# EAGLE design fabfm (EAGLE 6.3)
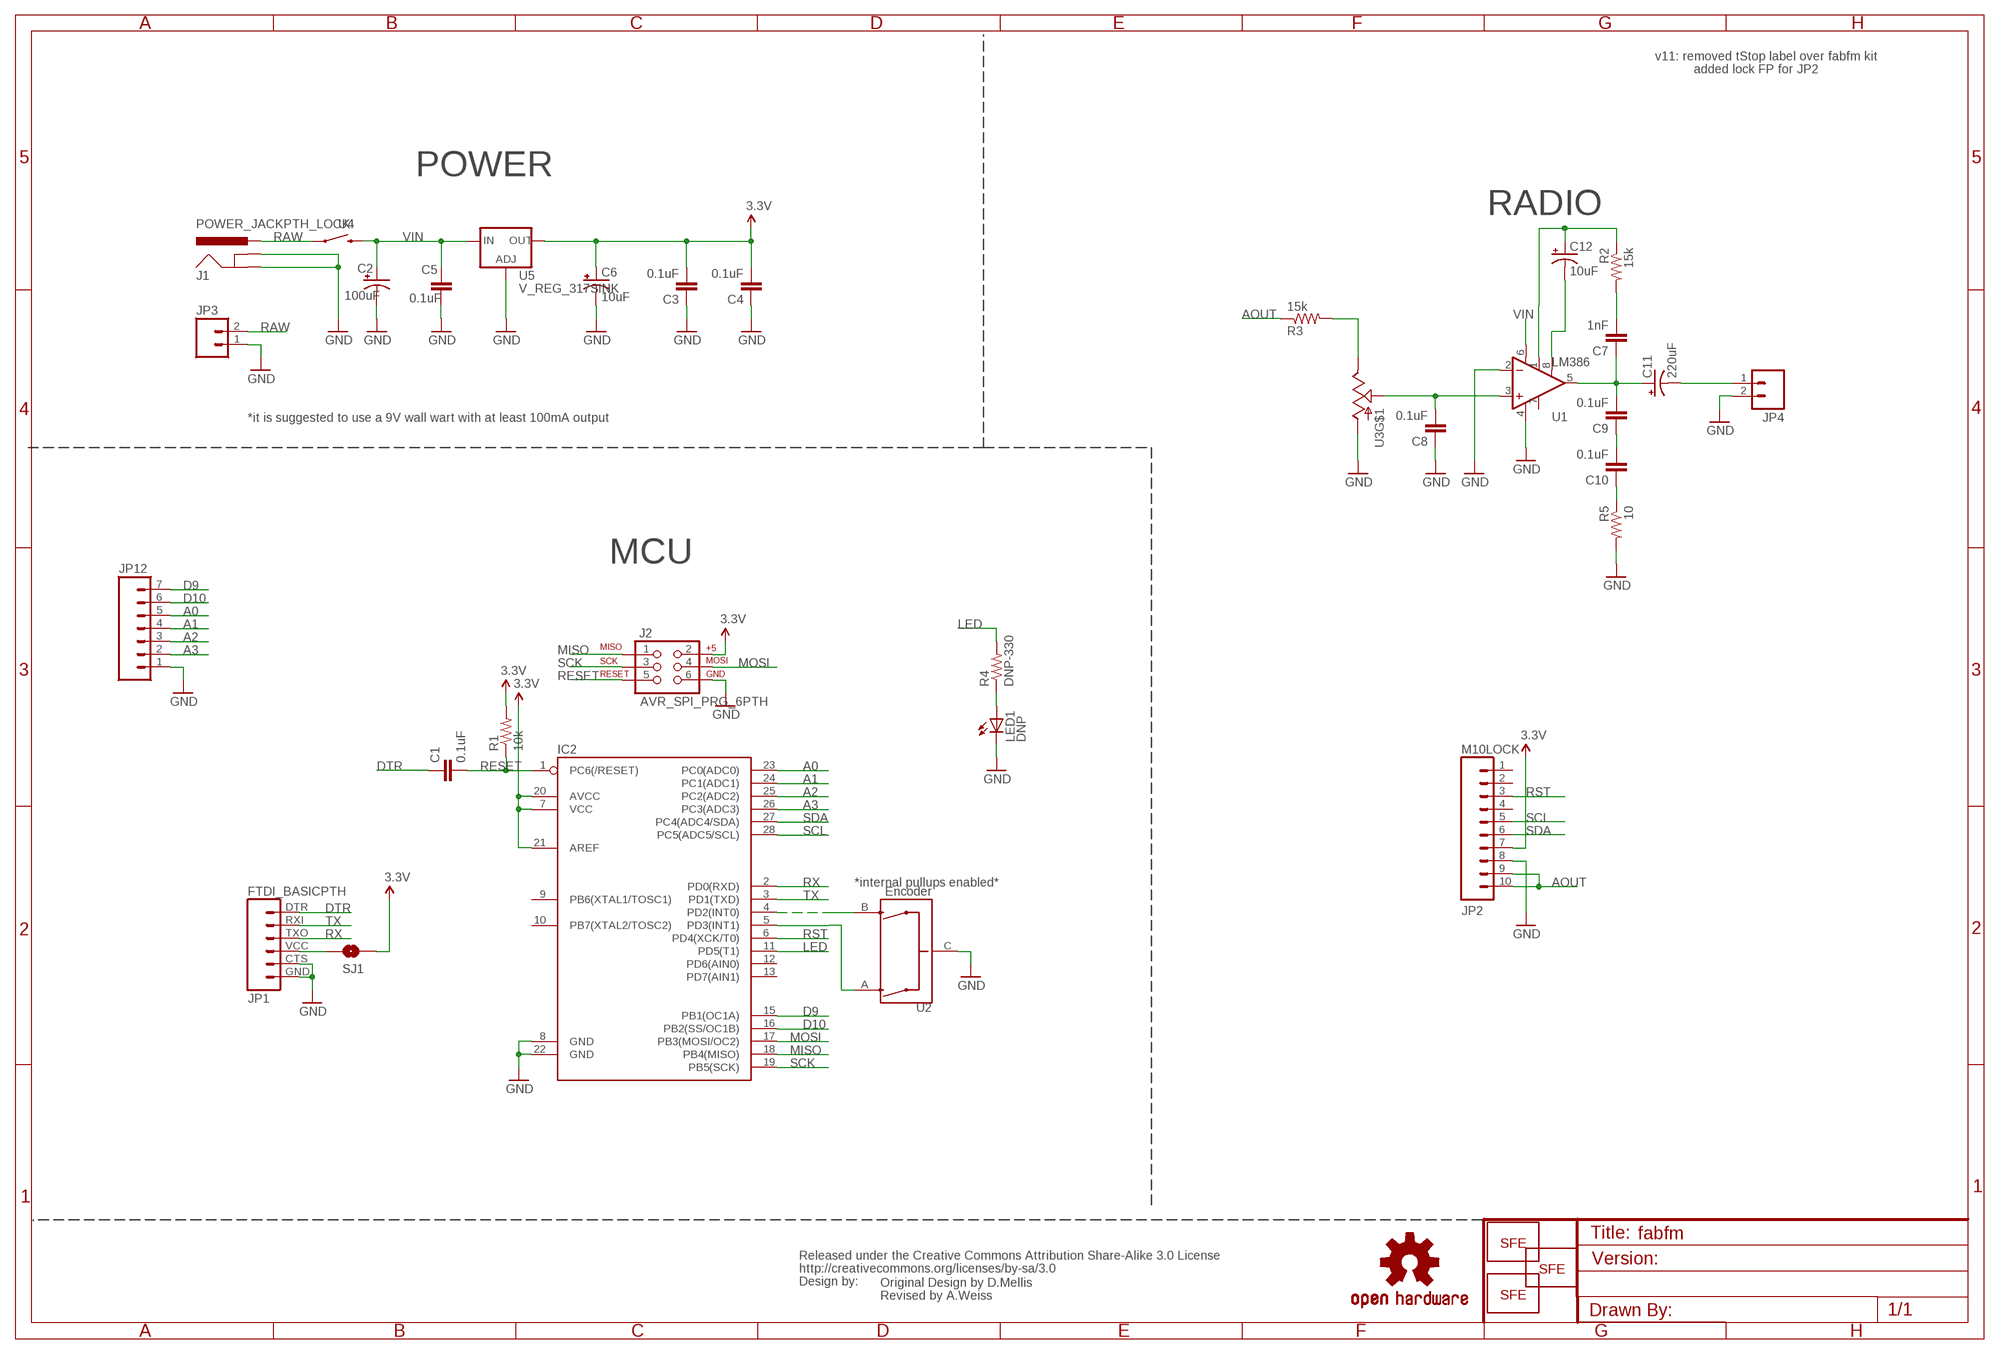
[diagram p0: schematic, sheet 1]

## Parts
C1  0.1uF  CAPKIT  [CAP-PTH-SMALL-KIT]
C2  100uF  CAP_POLPTH1  [CPOL-RADIAL-100UF-25V]
C3  0.1uF  CAPKIT  [CAP-PTH-SMALL-KIT]
C4  0.1uF  CAPKIT  [CAP-PTH-SMALL-KIT]
C5  0.1uF  CAPKIT  [CAP-PTH-SMALL-KIT]
C6  10uF  CAP_POLPTH2  [CPOL-RADIAL-10UF-25V]
C7  1nF  CAPKIT  [CAP-PTH-SMALL-KIT]
C8  0.1uF  CAPKIT  [CAP-PTH-SMALL-KIT]
C9  0.1uF  CAPKIT  [CAP-PTH-SMALL-KIT]
C10  0.1uF  CAPKIT  [CAP-PTH-SMALL-KIT]
C11  220uF  CAP_POLPTH1  [CPOL-RADIAL-100UF-25V]
C12  10uF  CAP_POLPTH2  [CPOL-RADIAL-10UF-25V]
IC2  ATMEGA328P_PDIP_EZ_PB0  [DIL28-EZ-PB0]
J1  POWER_JACKPTH_LOCK  [POWER_JACK_PTH_LOCK]
J2  AVR_SPI_PRG_6PTH  [2X3]
JP1  FTDI_BASICPTH  [FTDI_BASIC]
JP2  M10LOCK  [1X10_LOCK]
JP3  M02PTH  [1X02]
JP4  M02PTH4  [1X02_XTRA_BIG]
JP8  LOGO-SFESK  [SFE-LOGO-FLAME]
JP9  LOGO-SFENEW  [SFE-NEW-WEBLOGO]
JP11  LOGO-SFENEW  [SFE-NEW-WEBLOGO]
JP12  M07  [1X07]
LED1  DNP  LED3MM  [LED3MM]
R1  10k  RESISTORPTH-1/4W  [AXIAL-0.4]
R2  15k  RESISTORPTH-1/4W  [AXIAL-0.4]
R3  15k  RESISTORPTH-1/4W  [AXIAL-0.4]
R4  DNP-330  RESISTORPTH-1/4W  [AXIAL-0.4]
R5  10  RESISTORPTH-1/4W  [AXIAL-0.4]
SJ1  SOLDERJUMPERNO  [SJ_2S-NO]
U1  LM386  [DIP08]
U2  Encoder  ENCODER-QUADRATURE  [ENCODER-16MM-QUAD]
U3  POT_SWITCHPOT_PTH_SWITCH  [POT_PTH_SWITCH]
U5  V_REG_317SINK  [TO220-ADJ]
U$1  OSHW-LOGOS  [OSHW-LOGO-S]
U$2  CREATIVE_COMMONS  [CREATIVE_COMMONS]

## Nets
3.3V: C3.2 C4.2 C6.1(+) IC2.7(VCC) IC2.20(AVCC) IC2.21(AREF) J2.2 JP2.7 R1.P$2 SJ1.1 U5.OUT
A: IC2.5(PD3(INT1)) U2.A
A0: IC2.23(PC0(ADC0)) JP12.5
A1: IC2.24(PC1(ADC1)) JP12.4
A2: IC2.25(PC2(ADC2)) JP12.3
A3: IC2.26(PC3(ADC3)) JP12.2
AOUT: JP2.9 JP2.10 R3.P$1
B: IC2.4(PD2(INT0)) U2.B
D9: IC2.15(PB1(OC1A)) JP12.7
D10: IC2.16(PB2(SS/OC1B)) JP12.6
DTR: C1.1 JP1.DTR
GND: C2.2(-) C3.1 C4.1 C5.1 C6.2(-) C8.1 IC2.8(GND) IC2.22(GND) J1.GND J1.GNDBREAK J2.6 JP1.CTS JP1.GND JP2.8 JP3.1 JP4.2 JP12.1 LED1.K(C) R5.P$2 U1.2(-IN) U1.4(V-) U2.C U3.1(A) U5.ADJ
LED: IC2.11(PD5(T1)) R4.P$2
MISO: IC2.18(PB4(MISO)) J2.1
MOSI: IC2.17(PB3(MOSI/OC2)) J2.4
N$1: LED1.A R4.P$1
N$2: C8.2 U1.3(+IN) U3.2(S)
N$3: C7.1 C9.2 C11.1(+) U1.5(OUT)
N$4: C12.1(+) R2.P$1 U1.1(GAIN)
N$5: C11.2(-) JP4.1
N$6: C9.1 C10.2
N$7: C10.1 R5.P$1
N$8: C12.2(-) U1.8(GAIN)
N$9: C7.2 R2.P$2
N$10: R3.P$2 U3.3(E)
N$13: JP1.VCC SJ1.2
RAW: J1.PWR JP3.2 U3.S1
RESET: C1.2 IC2.1(PC6(/RESET)) J2.5 R1.P$1
RST: IC2.6(PD4(XCK/T0)) JP2.3
RX: IC2.2(PD0(RXD)) JP1.TXO
SCK: IC2.19(PB5(SCK)) J2.3
SCL: IC2.28(PC5(ADC5/SCL)) JP2.5
SDA: IC2.27(PC4(ADC4/SDA)) JP2.6
TX: IC2.3(PD1(TXD)) JP1.RXI
VIN: C2.1(+) C5.2 U1.6(V+) U3.S2 U5.IN
Unconnected: IC2.9(PB6(XTAL1/TOSC1)) IC2.10(PB7(XTAL2/TOSC2)) IC2.12(PD6(AIN0)) IC2.13(PD7(AIN1)) JP2.1 JP2.2 JP2.4 U1.7(BP)

## Notes on the sheet
- v11: removed tStop label over fabfm kit
- added lock FP for JP2
- POWER
- RADIO
- U4
- *it is suggested to use a 9V wall wart with at least 100mA output
- MCU
- *internal pullups enabled*
- Original Design by D.Mellis
- Revised by A.Weiss

## Library data of the parts
C1 C3-C5 C7-C10 = SparkFun:CAP: Capacitor Standard 0603 ceramic capacitor, and 0.1" leaded capacitor.
C2 C6 C11 C12 = SparkFun:CAP_POL: Capacitor Polarized These are standard SMD and PTH capacitors. Normally 10uF, 47uF, and 100uF in electrolytic and tantalum varieties. Always verify the external diameter of the through hole cap, it varies with capacity, voltage, and manufacturer. The EIA devices should be standard.
IC2 = SparkFun-DigitalIC:ATMEGA328P_PDIP_EZ_PB0: Polarized FP for kits with PB0 removed.
J1 = SparkFun-Connectors:POWER_JACK: Power Jack This is the standard 5.5mm barrel jack for power. The PTH is the most common, proven, reliable, footprint. All others are experimental. The Slot footprint only works if the mill layer is transmitted to the PCB fab house so be warned. Spark Fun Electronics SKU : PRT-00119. Mating wall wart : TOL-00298 (and others)
J2 = SparkFun:AVR_SPI_PRG_6: AVR ISP 6 Pin This is the reduced ISP connector for AVR programming. Common on Arduino. This footprint will take up less PCB space and can be used with a 10-pin to 6-pin adapter such as SKU: BOB-08508
JP1 = SparkFun:FTDI_BASIC: FTDI Basic: 3.3V and 5V
JP2 = SparkFun-Connectors:M10: Header 10 Standard 10-pin 0.1" header. Use with straight break away headers (SKU : PRT-00116), right angle break away headers (PRT-00553), swiss pins (PRT-00743), machine pins (PRT-00117), and female headers (PRT-00115).
JP3 JP4 = SparkFun:M02: Header 2 Standard 2-pin 0.1" header. Use with straight break away headers (SKU : PRT-00116), right angle break away headers (PRT-00553), swiss pins (PRT-00743), machine pins (PRT-00117), and female headers (PRT-00115). Molex polarized connector foot print use with SKU : PRT-08233 with associated crimp pins and housings.
JP8 JP9 JP11 = SparkFun:LOGO-SFE: Spark Fun Electronics PCB Logo This is the standard Spark Fun Electronics PCB logo.
JP12 = SparkFun-Connectors:M07: Header 7 Standard 7-pin 0.1" header. Use with straight break away headers (SKU : PRT-00116), right angle break away headers (PRT-00553), swiss pins (PRT-00743), machine pins (PRT-00117), and female headers (PRT-00115). NOTES ON THE VARIANTS LOCK and LOCK_LONGPADS... This footprint was designed to help hold the alignment of a through-hole component (i.e. 7-pin header) while soldering it into place. You may notice that each hole has been shifted either up or down by 0.005 of an inch from it's more standard position (which is usually a perfectly straight line). This slight alteration caused the pins (the squares in the middle) to touch the edges of the holes. Because they are alternating, it causes a "brace" to hold the header in place. 0.005 has proven to be the perfect amount of "off-center" position when using our standard breakaway headers. Although looks a little odd when you look at the bare footprint, once you have a header in there, the alteration is very hard to notice. Also, if you push a header all the way into place, it is covered up entirely on the bottom side. This idea of altering the position of holes to aid alignment will be further integrated into the Sparkfun Library for other footprints. It can help hold any component with 3 or more connection pins.
LED1 = SparkFun-LED:LED: LEDs Standard schematic elements and footprints for 5mm, 3mm, 1206, and 0603 sized LEDs. 5mm - Spark Fun Electronics SKU : COM-00529 (and others)
R1-R5 = SparkFun:RESISTOR: Resistor Basic schematic elements and footprints for 0603, 1206, and PTH resistors.
SJ1 = SparkFun-Passives:SOLDERJUMPER: Solder Jumper Standard SMD solder jumper. Used to automate production. Two varients : Normally Open and Normally Closed are the same, but have different paste layers. NC will have a large amount of paste and should jumper during reflow.
U1 = SparkFun-AnalogIC:LM386: low voltage audio power amplifier
U2 = SparkFun-Electromechanical:ENCODER-QUADRATURE: quadrature encoder from Top-Up, part#EC16PHBF-B-20F-24-24C-16Y
U3 = SparkFun-Electromechanical:POT_SWITCH: Potentiometer w/ switch.
U5 = SparkFun:V_REG_317: Voltage Regulator Standard LM317 adjustable voltage regulator. AOI (Adjust Output Input). Google 'LM317 Calculator' for easy to use app to get the two resistor values needed. 240/720 for 5V output. 240/390 for 3.3V output. Spark Fun Electronics SKU : COM-00527
U$1 = SparkFun:OSHW-LOGO: Open Source Hardware Logo This logo indicates the piece of hardware it is found on incorporates a OSHW license and/or adheres to the definition of open source hardware found here: http://freedomdefined.org/OSHW
U$2 = SparkFun:CREATIVE_COMMONS

## Board
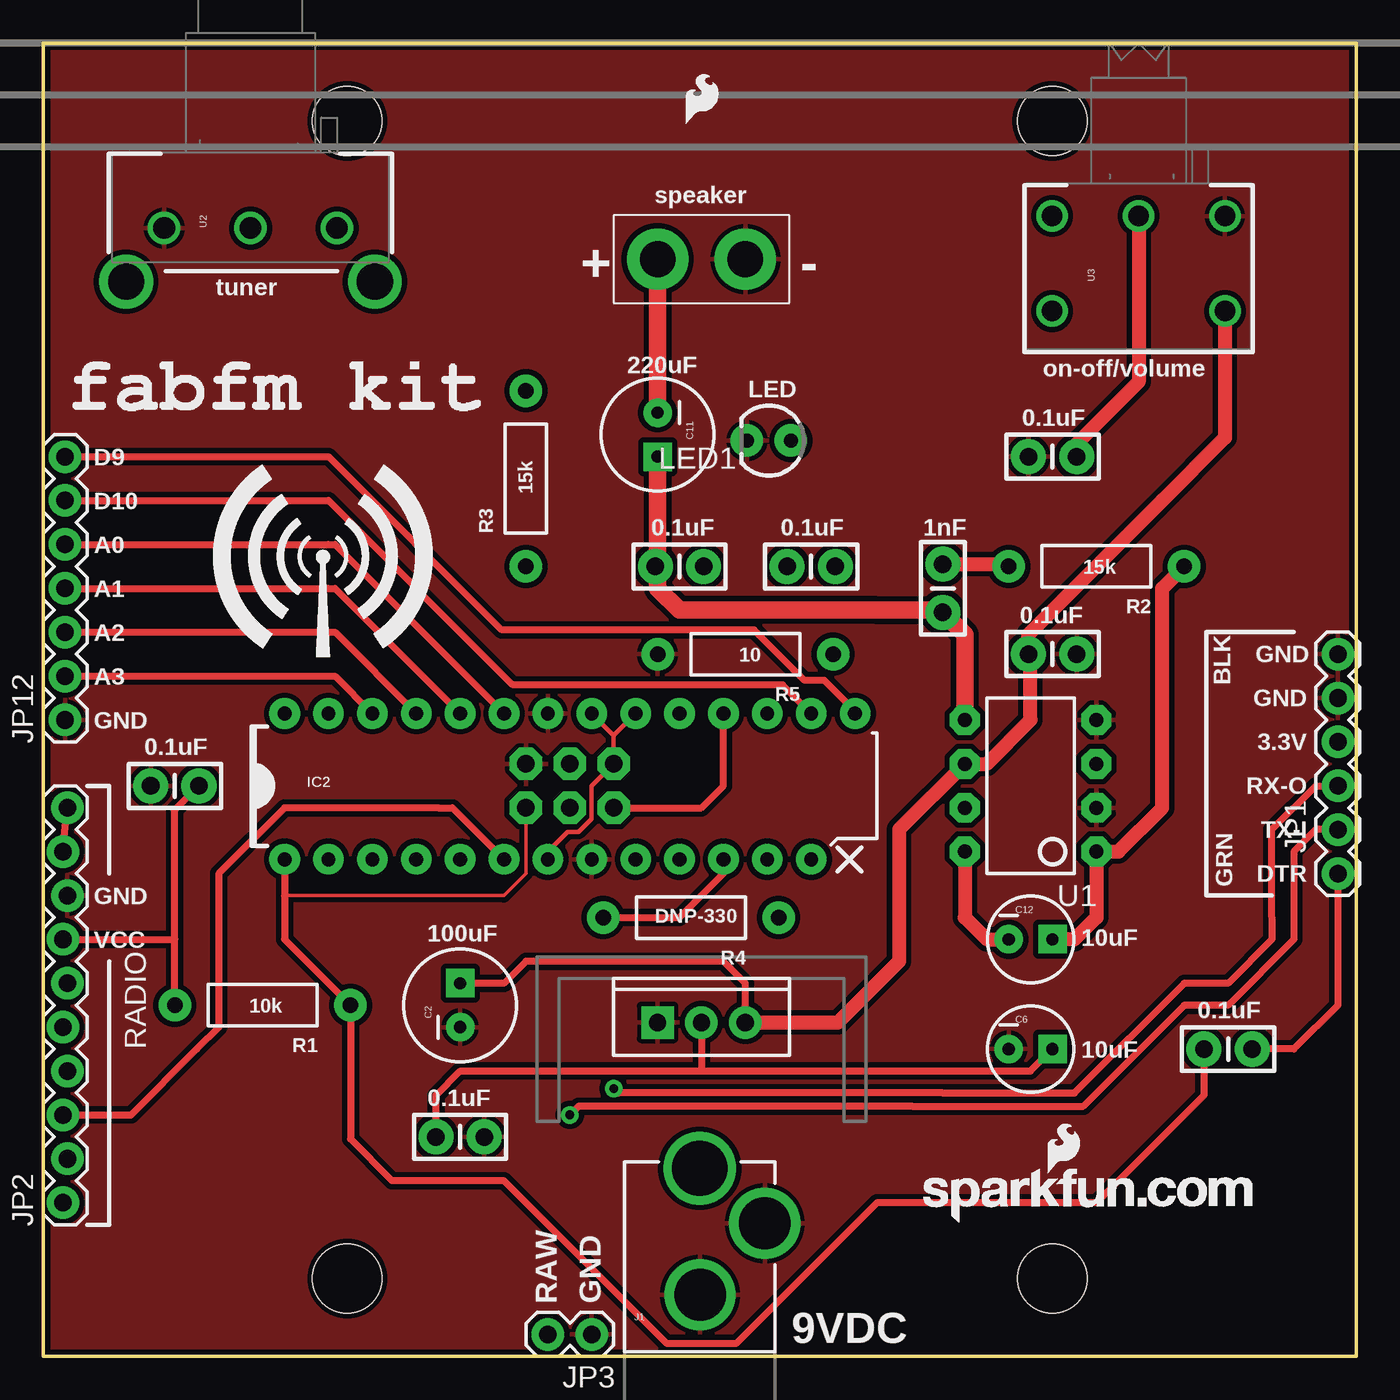
[diagram p1: board, top side]
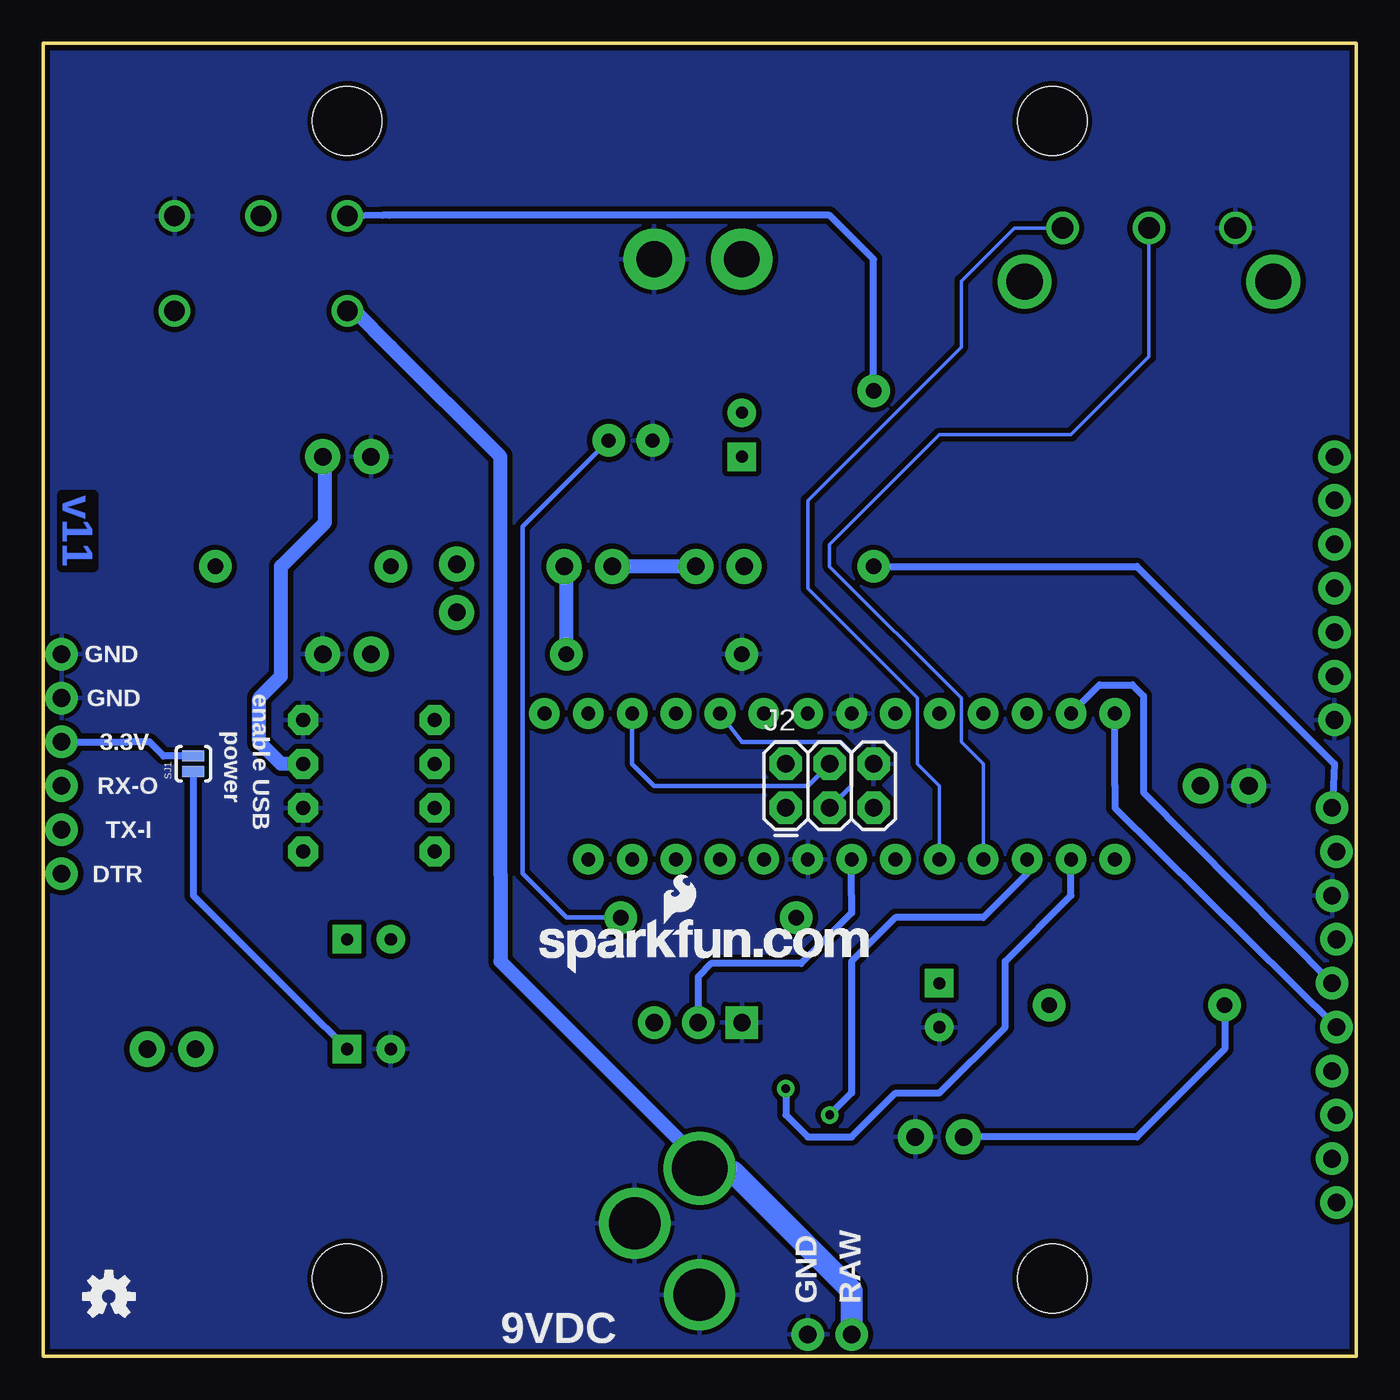
[diagram p2: board, bottom side, seen from below]

Size 76 x 76 mm. Coordinates in mm from the lower left corner, seen from the top.
Outline: 0,0 76,0 76,76 0,76 0,0
Copper layers (1*16): Top 0.0356mm / dielectric 1.5011mm / Bottom 0.0356mm
Design rules "default": minimum track width 8mil, minimum drill 20mil, track to track 8mil, track to pad 8mil, pad to pad 8mil, via to via 8mil, smd to smd 8mil, copper to edge 10mil, drill to drill 8mil, minimum pad ring 12mil, minimum via ring 10mil, stop-mask expansion 4mil, vias tented up to drill 20mil, thermal gap 10mil
Holes 4 mm at 17.6,71.5 58.4,71.5 17.6,4.5 58.4,4.5

### Footprints (pad centres in the part's own frame; a part is rotated, then mirrored left to right if it is on the bottom)
CAP-PTH-SMALL-KIT = drill 1.016 pad 2.032: 1 -1.397,0; 2 1.397,0
CPOL-RADIAL-100UF-25V = drill 0.7 pad 1.651 square: 1 1.27,0 | drill 0.7 pad 1.651: 2 -1.27,0
CPOL-RADIAL-10UF-25V = drill 0.7 pad 1.651 square: 1 1.27,0 | drill 0.7 pad 1.651: 2 -1.27,0
DIL28-EZ-PB0 = drill 0.8 pad 1.778: 1 -15.24,-4.255; 2 -12.7,-4.255; 3 -10.16,-4.255; 4 -7.62,-4.255; 5 -5.08,-4.255; 6 -2.54,-4.255; 7 0,-4.255; 8 2.54,-4.255; 9 5.08,-4.255; 10 7.62,-4.255; 11 10.16,-4.255; 12 12.7,-4.255; 13 15.24,-4.255; 15 17.78,4.191; 16 15.24,4.191; 17 12.7,4.191; 18 10.16,4.191; 19 7.62,4.191; 20 5.08,4.191; 21 2.54,4.191; 22 0,4.191; 23 -2.54,4.191; 24 -5.08,4.191; 25 -7.62,4.191; 26 -10.16,4.191; 27 -12.7,4.191; 28 -15.24,4.191
POWER_JACK_PTH_LOCK = drill 2.997 pad 4.115: GND 0.025,6.557; GNDBREAK 3.762,10.7 | drill 3.2 pad 4.115: PWR 0,13.878
2X3 = drill 1.016 pad 1.88 octagon: 1 0,0; 2 0,2.54; 3 2.54,0; 4 2.54,2.54; 5 5.08,0; 6 5.08,2.54
FTDI_BASIC = drill 1.016 pad 1.88: CTS 10.16,0; DTR 0,0; GND 12.7,0; RXI 2.54,0; TXO 5.08,0; VCC 7.62,0
1X10_LOCK = drill 1.016 pad 1.88: 1 0,0.127; 2 2.54,-0.127; 3 5.08,0.127; 4 7.62,-0.127; 5 10.16,0.127; 6 12.7,-0.127; 7 15.24,0.127; 8 17.78,-0.127; 9 20.32,0.127; 10 22.86,-0.127
1X02 = drill 1.016 pad 1.88: 1 0,0; 2 2.54,0
1X02_XTRA_BIG = drill 2.057 pad 3.556: 1 -2.54,0; 2 2.54,0
1X07 = drill 1.016 pad 1.88: 1 0,0; 2 2.54,0; 3 5.08,0; 4 7.62,0; 5 10.16,0; 6 12.7,0; 7 15.24,0
LED3MM = drill 0.813 pad 1.88: A -1.27,0; K 1.27,0
AXIAL-0.4 = drill 0.9 pad 1.88: P$1 -5.08,0; P$2 5.08,0
SJ_2S-NO = smd 0.635 x 1.27: 1 -0.45,0; 2 0.45,0
DIP08 = drill 0.813 pad 1.727 octagon: 1 -3.81,-3.81; 2 -1.27,-3.81; 3 1.27,-3.81; 4 3.81,-3.81; 5 3.81,3.81; 6 1.27,3.81; 7 -1.27,3.81; 8 -3.81,3.81
ENCODER-16MM-QUAD = drill 1.25: A 0,-5; B 0,0; C 0,5 | drill 2.1: P$1 -3.1,7.2; P$2 -3.1,-7.2
POT_PTH_SWITCH = drill 1.2: 1 0,-5; 2 0,0; 3 0,5; S1 -5.5,5; S2 -5.5,-5
TO220-ADJ = drill 1 pad 1.88 square: ADJ -2.54,0 | drill 1 pad 1.88: IN 2.54,0; OUT 0,0

### Placement (x,y rotation side)
C1  68.58,17.78 180 top
C2  24.13,20.32 90 top
C3  24.13,12.7 180 top
C4  7.62,33.02 0 top
C5  58.42,40.64 180 top
C6  57.15,17.78 0 top
C7  52.07,44.45 90 top
C8  58.42,52.07 0 top
C9  36.83,45.72 180 top
C10  44.45,45.72 180 top
C11  35.56,53.34 270 top
C12  57.15,24.13 0 top
IC2  29.21,33.02 0 top
J1  38,-3 0 top
J2  33.02,31.75 0 bottom
JP1  74.93,27.94 90 top
JP2  1.27,8.89 90 top
JP3  31.75,1.27 180 top
JP4  38.1,63.5 0 top
JP8  37.21,71.37 0 top
JP9  50.93,7.75 0 top
JP11  47.29,22.16 0 bottom
JP12  1.27,36.83 90 top
LED1  42,53 180 top
R1  12.7,20.32 180 top
R2  60.96,45.72 180 top
R3  27.94,50.8 90 top
R4  37.49,25.39 180 top
R5  40.64,40.64 180 top
SJ1  67.31,34.29 90 bottom
U1  57.15,33.02 90 top
U2  12,65.3 90 top
U3  63.4,66 90 top
U5  38.1,19.32 0 top
U$1  72.2,3.46 0 bottom
U$2  -1.27,-1.27 0 top

### Tracks (layer width: path | path; a pad name or v marks a point on that pad's centre or on a via)
3.3V
  Top 0.254: 33.02,35.94 J2.2 31.75,33.02 31.75,31.11 30.99,30.35 30.35,30.35 29.21,29.21 IC2.7 | 33.02,35.94 IC2.21 | 33.02,35.94 IC2.20
  Top 0.406: U5.OUT 38.1,19.05 38.1,16.51 | C3.2 22.73,15.11 24.13,16.51 36.83,16.51 38.1,16.51 | 38.1,16.51 43.18,16.51 54.61,16.51 57.15,16.51 C6.1 | R1.P$2 7.62,24.13 | 7.62,24.13 7.62,31.62 C4.2 | JP2.7 7.62,24.13
  Bottom 0.406: R1.P$2 7.62,17.78 11.43,13.97 12.7,12.7 C3.2 | SJ1.1 67.31,26.67 60.96,20.32 C6.1 | IC2.7 29.21,26.67 29.21,25.65 32.13,22.73 37.34,22.73 38.1,21.97 U5.OUT
A
  Bottom 0.203: IC2.5 24.13,33.02 25.4,34.29 25.4,38.1 31.75,44.45 31.75,49.53 22.86,58.42 22.86,60.96 22.86,62.23 20.32,64.77 19.79,65.3 U2.A
A0
  Top 0.406: JP12.5 16.51,46.99 16.89,46.99 IC2.23
A1
  Top 0.406: JP12.4 16.51,44.45 16.89,44.45 IC2.24
A2
  Top 0.406: JP12.3 16.51,41.91 16.89,41.91 IC2.25
A3
  Top 0.406: JP12.2 16.51,39.37 16.89,39.37 IC2.26
AOUT
  Top 0.406: JP2.9 JP2.10
  Bottom 0.406: R3.P$1 12.7,45.72 1.27,34.29 JP2.10
B
  Bottom 0.203: IC2.4 21.59,34.29 22.86,35.56 22.86,38.1 30.48,45.72 30.48,46.99 24.13,53.34 16.51,53.34 12,57.85 U2.B
D9
  Top 0.406: IC2.15 46.99,37.34 45.21,39.12 44.07,39.12 41.15,42.04 26.54,42.04 16.51,52.07 JP12.7
D10
  Top 0.406: JP12.6 16.51,49.53 27.18,38.86 42.8,38.86 IC2.16
DTR
  Top 0.406: JP1.DTR 74.93,20.32 72.39,17.78 C1.1
GND
  pour Bottom (isolate 0.305): 0,76 0,0 76,0 76,76
  pour Top (isolate 0.305): 0,76 0,0 76,0 76,76
LED
  Top 0.406: R4.P$2 36.82,25.39 39.37,27.94 IC2.11
MISO
  Top 0.406: J2.1 38.1,31.75 39.37,33.02 IC2.18
MOSI
  Bottom 0.254: IC2.17 41.91,34.29 40.64,33.02 31.75,33.02 J2.4
N$1
  Bottom 0.254: R4.P$1 45.71,25.39 48.26,27.94 48.26,48.01 LED1.A
N$2
  Top 0.813: C8.2 59.82,52.82 62.5,55.5 | 62.5,55.5 63,56 | U3.2 63.4,56.4 62.5,55.5
  Bottom 0.406: 59.69,51.94 C8.2
  Bottom 0.813: U1.3 62.23,34.29 63.5,35.56 63.5,38.1 62.23,39.37 62.23,45.72 59.69,48.26 59.69,51.94
N$3
  Top 0.406: 35.56,45.72 C9.2
  Top 1.016: C11.1 35.56,45.72 | C9.2 35.56,45.59 35.56,44.45 36.83,43.18 48.26,43.18 51.94,43.18 C7.1 53.34,41.78 U1.5
N$4
  Top 0.813: C12.1 59.69,24.13 60.96,25.4 U1.1 62.23,29.21 64.77,31.75 64.77,44.45 R2.P$1
N$5
  Top 1.016: JP4.1 C11.2
N$6
  Bottom 0.813: C9.1 C10.2
N$7
  Bottom 0.254: 45.72,44.32 45.72,44.45
  Bottom 0.813: R5.P$1 45.72,44.32 | 45.72,44.45 45.72,45.59 C10.1
N$8
  Top 0.813: U1.8 53.34,25.4 54.61,24.13 C12.2
N$9
  Top 0.813: C7.2 55.75,45.85 R2.P$2
N$10
  Bottom 0.406: R3.P$2 27.94,63.5 30.48,66.04 55.96,66.04 56.36,66.04 U3.3
N$13
  Bottom 0.406: JP1.VCC 71.12,35.56 | 69.85,35.56 71.12,35.56 | 69.85,35.56 71.12,35.56 | SJ1.2 69.03,34.74 69.85,35.56
RAW
  Bottom 0.813: J1.PWR 38.37,11.7 48.26,21.59 49.53,22.86 49.53,27.94 49.53,50.8 49.53,52.07 55.88,58.42 57.96,60.5 U3.S1
  Bottom 1.27: JP3.2 29.21,3.81 33.02,7.62 35.56,10.16 36.1,10.7 J1.PWR
RESET
  Top 0.203: J2.5 27.94,27.94 26.67,26.67 13.97,26.67
  Top 0.406: IC2.1 13.97,26.67 13.97,24.13 R1.P$1 17.78,12.57 20.19,10.16 26.67,10.16 30.48,6.35 34.29,2.54 35.56,1.27 36.07,0.76 40.13,0.76 40.64,1.27 41.91,2.54 48.26,8.89 60.96,8.89 67.18,15.11 C1.2
RST
  Top 0.406: JP2.3 5.08,13.97 8.89,17.78 10.16,19.05 10.16,27.94 13.97,31.75 22.86,31.75 23.69,31.75 IC2.6
RX  (via drill 0.51)
  Top 0.406: v33.02,15.49 33.27,15.24 52.07,15.24 59.69,15.24 66.04,21.59 68.58,21.59 71.12,24.13 71.12,25.4 71.12,30.48 73.66,33.02 JP1.TXO
  Bottom 0.406: v33.02,15.49 33.02,13.97 31.75,12.7 29.21,12.7 26.67,15.24 24.13,15.24 20.32,19.05 20.32,22.86 16.51,26.67 IC2.2
SCK
  Bottom 0.254: J2.3 29.21,33.02 29.21,34.92 29.84,35.56 35.56,35.56 IC2.19
SCL
  Bottom 0.406: IC2.28 13.97,33.02 13.97,31.75 JP2.5
SDA
  Bottom 0.406: IC2.27 14.86,38.86 12.95,38.86 12.32,38.23 12.32,32.64 JP2.6
TX  (via drill 0.51)
  Top 0.406: v30.48,13.97 30.99,14.48 50.29,14.48 60.2,14.48 66.04,20.32 68.58,20.32 72.39,24.13 72.39,26.67 72.39,29.21 73.66,30.48 JP1.RXI
  Bottom 0.406: IC2.3 19.05,27.94 21.59,25.4 26.67,25.4 29.21,22.86 29.21,15.24 v30.48,13.97
VIN
  Top 0.406: U5.IN 40.64,21.59 39.37,22.86 27.94,22.86 26.67,21.59 C2.1 | 57.15,40.51 C5.2
  Top 0.813: 57.15,40.51 57.15,36.83 54.61,34.29 U1.6 49.53,30.48 49.53,22.86 46.99,20.32 45.99,19.32 U5.IN | C5.2 57.02,41.78 64.77,49.53 68.4,53.16 U3.S2

### Text on the board
Bottom: v11
tPlace: speaker | + | - | tuner | 220uF | on-off/volume | LED | 0.1uF | D9 | D10 | 0.1uF | 0.1uF | 1nF | A0 | A1 | 0.1uF | A2 | GND | A3 | BLK | GND | GND | 3.3V | 0.1uF | RX-O | TX-I | DTR | GRN | GND | VCC | 100uF | 10uF | 0.1uF | RADIO | 10uF | 0.1uF | RAW | GND | 9VDC
bPlace: GND | GND | enable USB | power | 3.3V | RX-O | TX-I | DTR | RAW | GND | 9VDC
tDocu: BACK